# Altium schematic sheet IOpin.SchDoc
size A
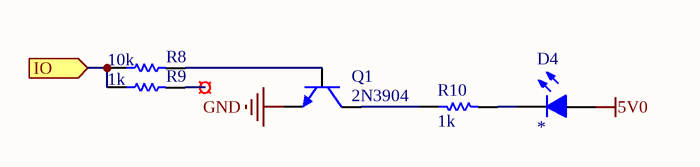
[diagram p0: IOpin.SchDoc]

## Parts
D4  (no value)  [LED-0603-K1A2]
Q1  2N3904  [SOT95P245X110-3N]
R8  value 10k  [RES 0603_N]  (hidden comment: Res)
R9  value 1k  [RES 0603_N]  (hidden comment: Res)
R10  value 1k  [RES 0603_N]  (hidden comment: Res)
TP31  (no value)  [THTP]

## Ports
IO (in)

## Nets
5V0: D4.2(A)
GND: Q1.2(E)
IO: R8.1 R9.1 ; port IO
NetD4_1: D4.1(K) R10.2
NetQ1_1: Q1.1(B) R8.2
NetQ1_3: Q1.3(C) R10.1
NetR9_2: R9.2 TP31.1

## Library data of the parts
D4 = -LED K1A2: 2 Pin LED K1A2; Label: *
Q1 = 2N3904: NPN General Purpose Amplifier; Published: 8-Jun-2000; LatestRevisionDate: 15-Jan-2003; LatestRevisionNote: PCB Footprint 'BCY-W3/D4.7' replaced; DatasheetVersion: 1997; PackageVersion: Sep-1998; PackageReference: TO-92A; Publisher: Altium Limited; PackageDescription: TO, Flat Index; 3 In-Line, Axial Leads; Body Dia. 4.5mm; Leads 0.51 x 0.48 mm (max); ComponentLink1Description: Manufacturer Link; ComponentLink1URL: http://www.fairchildsemi.com/; ComponentLink2Description: Datasheet; ComponentLink2URL: http://www.fairchildsemi.com/ds/2N%2F2N3904.pdf
R8-R10 = Res: Resistor; Published: 8-Jun-2000; LatestRevisionDate: 17-Jul-2002; LatestRevisionNote: Re-released for DXP Platform.; PackageReference: AXIAL-0.3; Publisher: Altium Limited; PackageDescription: Axial Device, Thru-Hole; 2 Leads; 0.3 in Pin Spacing
TP31 = THTP